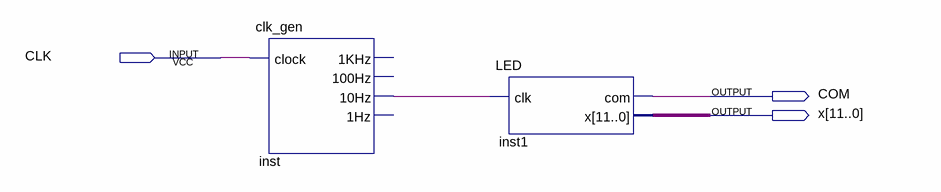
[diagram p0: schematic sheet]
// Quartus schematic LED2.bdf as structural Verilog: 2 symbols, 3 pins
module LED2 (
  input  CLK,
  output COM,
  output [11:0] x
);

  wire inst_10hz;

  clk_gen inst (.clock(CLK), .\10Hz (inst_10hz));  // open: 1KHz, 100Hz, 1Hz
  LED inst1 (.clk(inst_10hz), .com(COM), .x(x));
endmodule
